# EAGLE schematic updated_PCB (EAGLE 8.1.0)
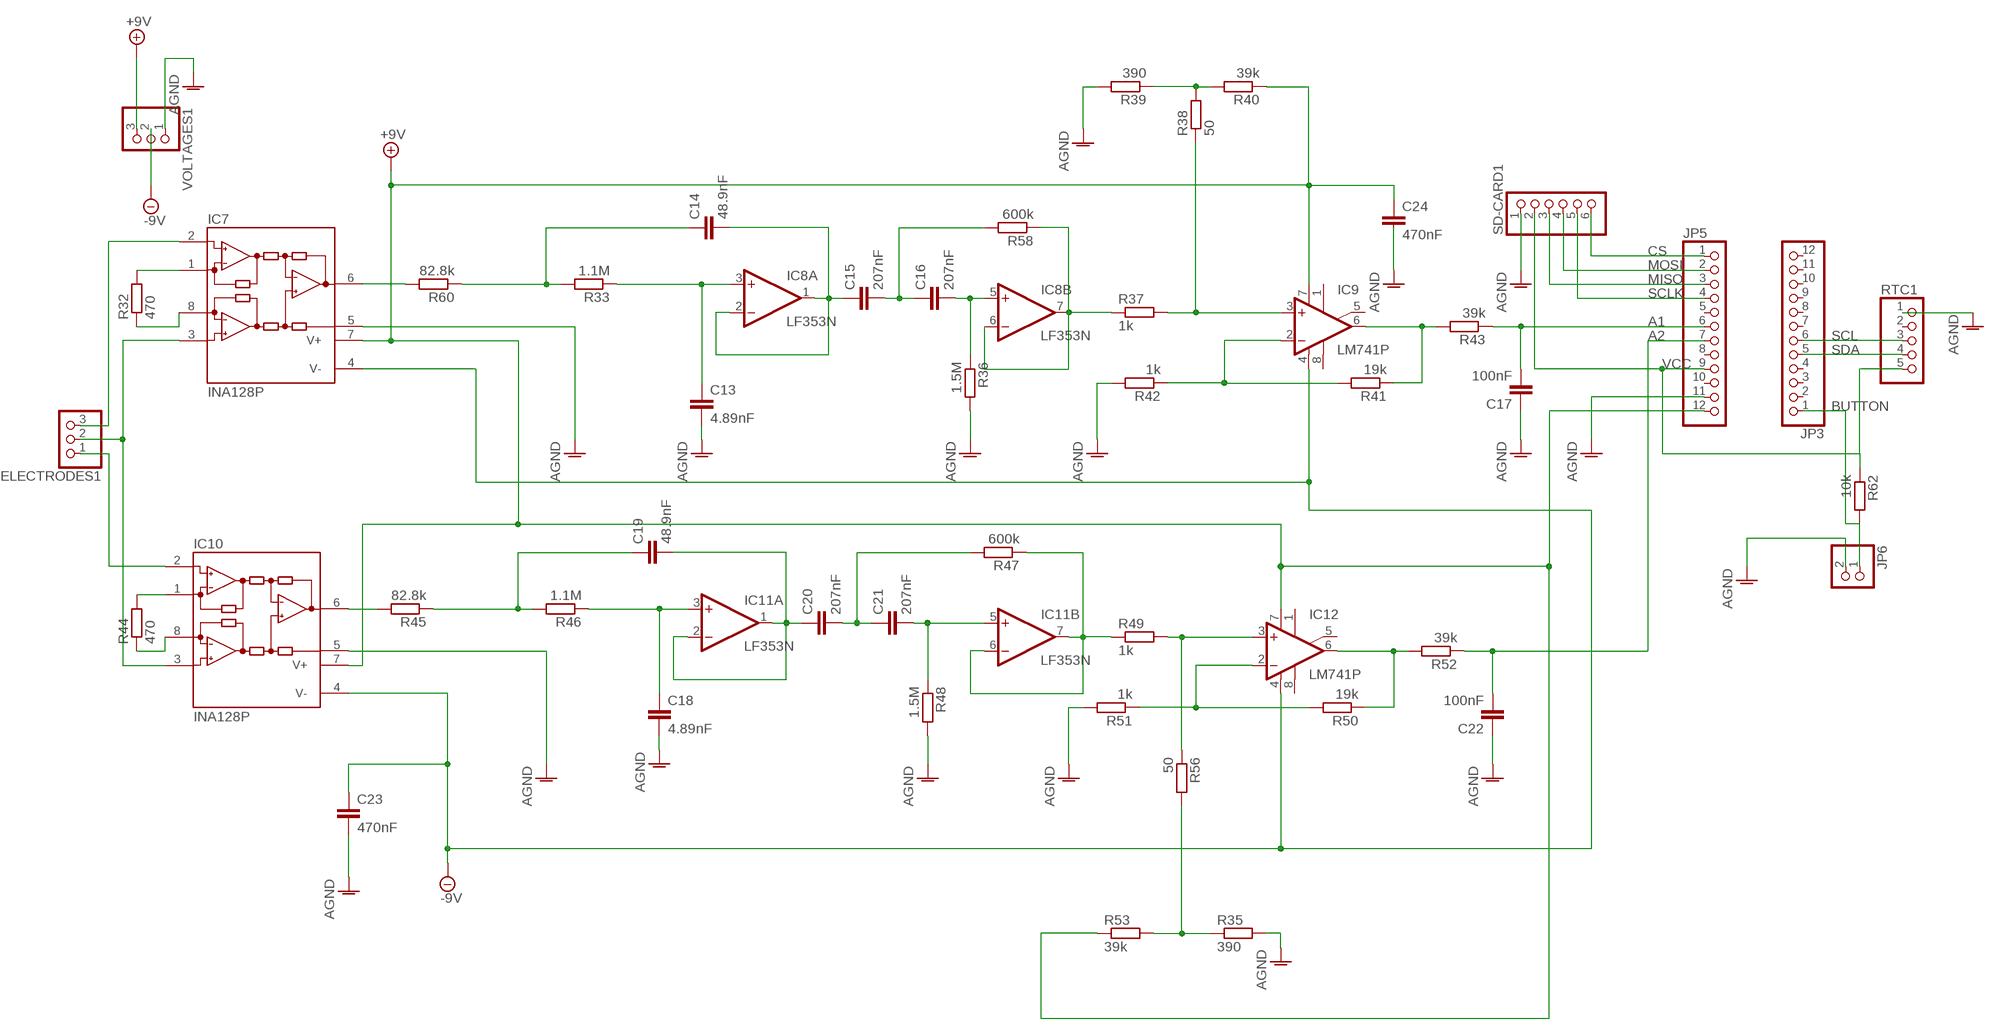
[diagram p0: schematic, sheet 1]

## Parts
C13  4.89nF  C-EU025-030X050  [C025-030X050]
C14  48.9nF  C-EU025-030X050  [C025-030X050]
C15  207nF  C-EU025-030X050  [C025-030X050]
C16  207nF  C-EU025-030X050  [C025-030X050]
C17  100nF  C-EU025-030X050  [C025-030X050]
C18  4.89nF  C-EU025-030X050  [C025-030X050]
C19  48.9nF  C-EU025-030X050  [C025-030X050]
C20  207nF  C-EU025-030X050  [C025-030X050]
C21  207nF  C-EU025-030X050  [C025-030X050]
C22  100nF  C-EU025-030X050  [C025-030X050]
C23  470nF  C-EU025-030X050  [C025-030X050]
C24  470nF  C-EU025-030X050  [C025-030X050]
ELECTRODES1  PINHD-1X3  [1X03]
IC7  INA128P  [DIL08]
IC8  LF353N  [DIL08]
IC9  LM741P  [DIL08]
IC10  INA128P  [DIL08]
IC11  LF353N  [DIL08]
IC12  LM741P  [DIL08]
JP3  PINHD-1X12  [1X12]
JP5  PINHD-1X12  [1X12]
JP6  PINHD-1X2  [1X02]
R32  470  R-EU_0309/12  [0309/12]
R33  1.1M  R-EU_0309/12  [0309/12]
R35  390  R-EU_0309/12  [0309/12]
R36  1.5M  R-EU_0309/12  [0309/12]
R37  1k  R-EU_0309/12  [0309/12]
R38  50  R-EU_0309/12  [0309/12]
R39  390  R-EU_0309/12  [0309/12]
R40  39k  R-EU_0309/12  [0309/12]
R41  19k  R-EU_0309/12  [0309/12]
R42  1k  R-EU_0309/12  [0309/12]
R43  39k  R-EU_0309/12  [0309/12]
R44  470  R-EU_0309/12  [0309/12]
R45  82.8k  R-EU_0309/12  [0309/12]
R46  1.1M  R-EU_0309/12  [0309/12]
R47  600k  R-EU_0309/12  [0309/12]
R48  1.5M  R-EU_0309/12  [0309/12]
R49  1k  R-EU_0309/12  [0309/12]
R50  19k  R-EU_0309/12  [0309/12]
R51  1k  R-EU_0309/12  [0309/12]
R52  39k  R-EU_0309/12  [0309/12]
R53  39k  R-EU_0309/12  [0309/12]
R56  50  R-EU_0309/12  [0309/12]
R58  600k  R-EU_0309/12  [0309/12]
R60  82.8k  R-EU_0309/12  [0309/12]
R62  10k  R-EU_0309/12  [0309/12]
RTC1  PINHD-1X5  [1X05]
SD-CARD1  PINHD-1X6  [1X06]
VOLTAGES1  PINHD-1X3  [1X03]

## Nets
+9V: C24.1 IC7.7(V+) IC9.7(V+) IC10.7(V+) IC12.7(V+) JP5.12 R40.1 R53.1 VOLTAGES1.3
-9V: C23.1 IC7.4(V-) IC9.4(V-) IC10.4(V-) IC12.4(V-) VOLTAGES1.2
A1: C17.2 JP5.6 R43.1
A2: C22.2 JP5.7 R52.1
AGND: C13.2 C17.1 C18.2 C22.1 C23.2 IC7.5(REF) IC10.5(REF) JP5.11 JP6.2 R35.2 R36.2 R39.2 R42.2 R48.2 R51.2 RTC1.1 SD-CARD1.1 VOLTAGES1.1
BUTTON: JP3.1 JP6.1 R62.2
CS: JP5.1 SD-CARD1.6
MISO: JP5.3 SD-CARD1.3
MOSI: JP5.2 SD-CARD1.4
N$36: IC7.1(RG) R32.2
N$38: R35.1 R53.2 R56.2
N$39: C14.2 C15.1 IC8.1(A:OUT) IC8.2(A:-IN)
N$40: C15.2 C16.1 R58.2
N$41: C16.2 IC8.5(B:+IN) R36.1
N$42: IC8.6(B:-IN) IC8.7(B:OUT) R37.1 R58.1
N$43: IC9.2(-IN) R41.2 R42.1
N$44: IC9.6(OUT) R41.1 R43.2
N$45: IC10.1(RG) R44.2
N$48: C19.2 C20.1 IC11.1(A:OUT) IC11.2(A:-IN)
N$49: C20.2 C21.1 R47.2
N$50: C21.2 IC11.5(B:+IN) R48.1
N$51: IC11.6(B:-IN) IC11.7(B:OUT) R47.1 R49.1
N$52: IC12.2(-IN) R50.2 R51.1
N$53: IC12.6(OUT) R50.1 R52.2
N$54: ELECTRODES1.2 IC7.3(+IN) IC10.3(+IN)
N$55: ELECTRODES1.1 IC10.2(-IN)
N$56: ELECTRODES1.3 IC7.2(-IN)
N$57: R38.2 R39.1 R40.2
N$59: C18.1 IC11.3(A:+IN) R46.1
N$60: C13.1 IC8.3(A:+IN) R33.1
N$63: IC10.6(OUT) R45.2
N$64: C14.1 R33.2 R60.1
N$65: IC7.6(OUT) R60.2
N$66: IC7.8(RG) R32.1
N$67: IC10.8(RG) R44.1
N$68: IC9.3(+IN) R37.2 R38.1
N$69: C19.1 R45.1 R46.2
N$70: IC12.3(+IN) R49.2 R56.1
SCL: JP3.6 RTC1.3
SCLK: JP5.4 SD-CARD1.5
SDA: JP3.5 RTC1.4
VCC: JP5.9 R62.1 RTC1.5 SD-CARD1.2
Unconnected: C24.2 IC9.1(ON1) IC9.5(ON2) IC9.8(OPT) IC12.1(ON1) IC12.5(ON2) IC12.8(OPT) JP3.2 JP3.3 JP3.4 JP3.7 JP3.8 JP3.9 JP3.10 JP3.11 JP3.12 JP5.5 JP5.8 JP5.10 RTC1.2

## Power pins joined to a net without a drawn wire
V+: IC8.8(P:V+) IC11.8(P:V+)
V-: IC8.4(P:V-) IC11.4(P:V-)

## Library data of the parts
C13-C24 = resistor:C-EU: CAPACITOR, European symbol
ELECTRODES1 VOLTAGES1 = pinhead:PINHD-1X3: PIN HEADER
IC7 IC10 = burr-brown:INA128: Instrumentation Amplifiers Precision, Low Power; MF: TEXAS INSTRUMENTS; MPN: INA128P; OC_FARNELL: 1212410; OC_NEWARK: 74C9783
IC8 IC11 = linear:LF353: OP AMP
IC9 IC12 = linear:*741: OP AMP
JP3 JP5 = pinhead:PINHD-1X12: PIN HEADER
JP6 = pinhead:PINHD-1X2: PIN HEADER
R32 R33 R35-R53 R56 R58 R60 R62 = rcl:R-EU_: RESISTOR, European symbol
RTC1 = pinhead:PINHD-1X5: PIN HEADER
SD-CARD1 = pinhead:PINHD-1X6: PIN HEADER